# EAGLE design circuit1 (EAGLE 9.2.2)
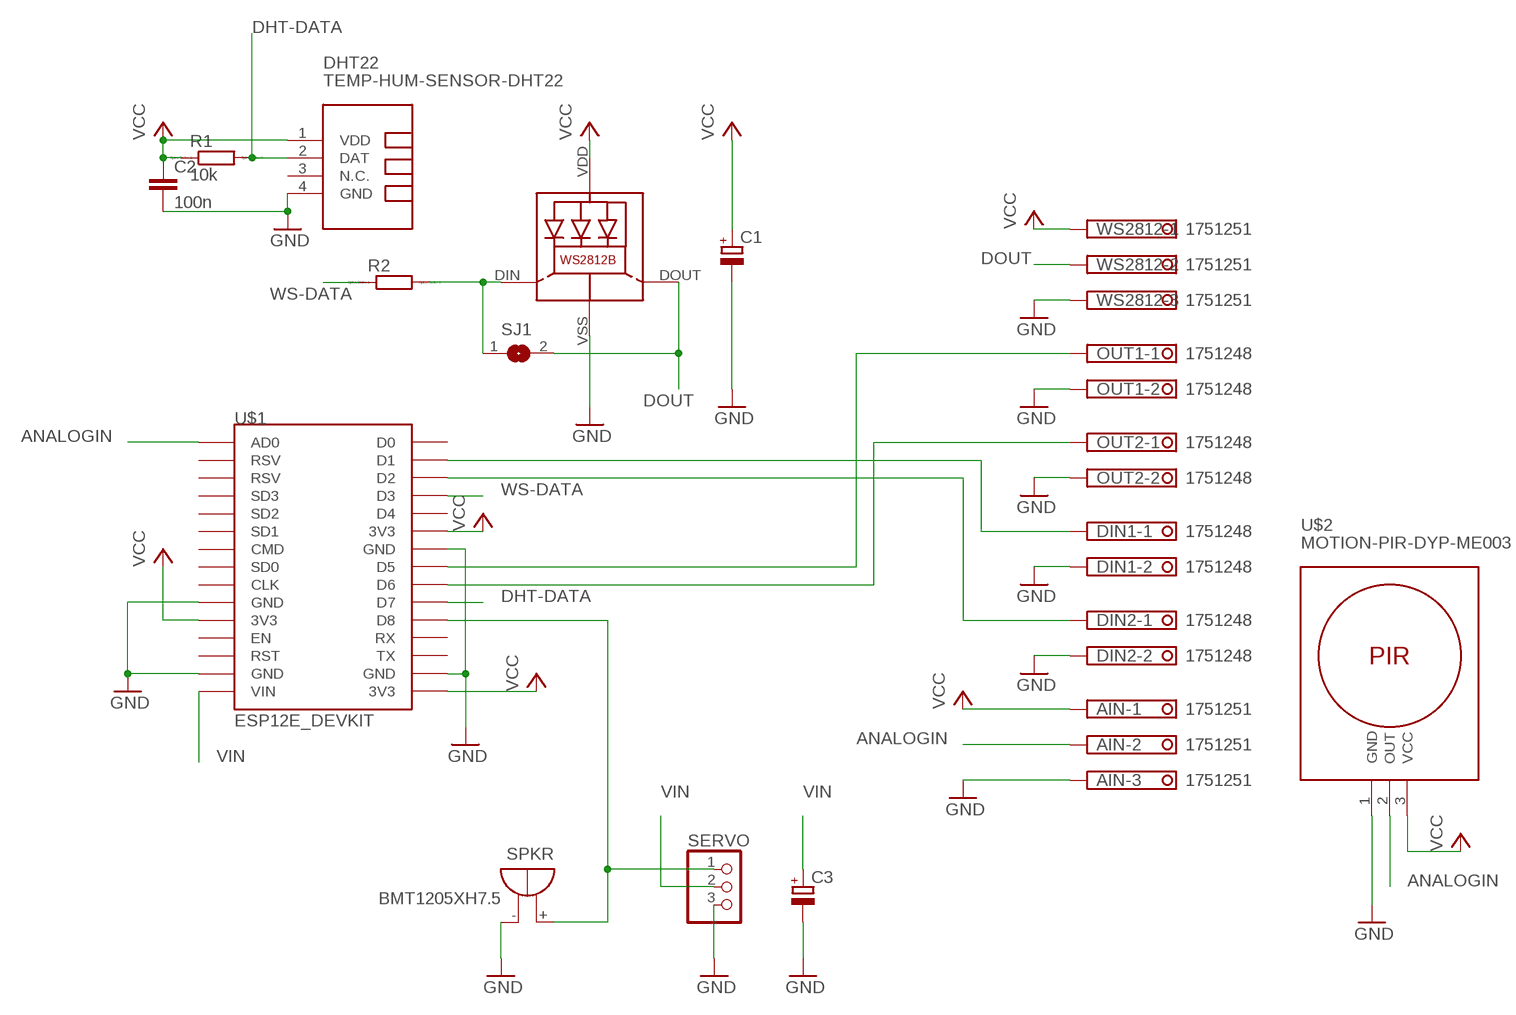
[diagram p0: schematic, sheet 1]

## Parts
AIN  1751251  [1751251]
C1  CPOL-EUE2.5-7  [E2,5-7]
C2  100n  C-EUC0805  [C0805]
C3  CPOL-EUE2.5-7  [E2,5-7]
DHT22  TEMP-HUM-SENSOR-DHT22  [TEMP-HUM-SENSOR-DHT22]
DIN1  1751248  [1751248]
DIN2  1751248  [1751248]
LED1  WS2812B  [WS2812B]
OUT1  1751248  [1751248]
OUT2  1751248  [1751248]
R1  10k  R0207/10  [0207/10]
R2  R0207/10  [0207/10]
SERVO  PINHD-1X3  [1X03]
SJ1  SJ  [SJ]
SPKR  BMT1205XH7.5  [BMT1205XH7.5]
U$1  ESP12E_DEVKIT  [ESP12E_DEVKIT]
U$2  MOTION-PIR-DYP-ME003  [MOTION-PIR-DYP-ME003]
WS2812  1751251  [1751251]

## Nets
ANALOGIN: AIN.2 U$1.AD0 U$2.2(OUT)
DHT-DATA: DHT22.2(DAT) R1.2 U$1.D7
DOUT: LED1.DOUT(DO) SJ1.2 WS2812.2
GND: AIN.3 C1.- C2.2 C3.- DHT22.4(GND) DIN1.2 DIN2.2 LED1.VSS(GND) OUT1.2 OUT2.2 SERVO.3 SPKR.- U$1.GND@0(GND) U$1.GND@1(GND) U$1.GND@2(GND) U$1.GND@3(GND) U$2.1(GND) WS2812.3
N$1: SERVO.1 SPKR.+ U$1.D8
N$5: OUT1.1 U$1.D5
N$7: OUT2.1 U$1.D6
N$9: DIN1.1 U$1.D1
N$11: DIN2.1 U$1.D2
VCC: AIN.1 C1.+ C2.1 DHT22.1(VDD) LED1.VDD R1.1 U$1.3V3@0(3V3) U$1.3V3@1(3V3) U$1.3V3@2(3V3) U$2.3(VCC) WS2812.1
VIN: C3.+ SERVO.2 U$1.VIN
WS: LED1.DIN(DI) R2.2 SJ1.1
WS-DATA: R2.1 U$1.D3
Unconnected: DHT22.3(N.C.) U$1.CLK U$1.CMD U$1.D0 U$1.D4 U$1.EN U$1.RST U$1.RSV@0(RSV) U$1.RSV@1(RSV) U$1.RX U$1.SD0 U$1.SD1 U$1.SD2 U$1.SD3 U$1.TX

## Library data of the parts
AIN WS2812 = con-phoenix-350:1751251: MKDS 1/ 3-3,5 Printklemme Nennstrom: 10 A Bemessungsspannung: 160 V Raster: 3,5 mm Polzahl: 3 Montageart: Löten Anschlussart: Schraubanschluss Anschlussrichtung vom Leiter zur Platine: 0° Source: http://eshop.phoenixcontact.com .. 1751251.pdf; OC_FARNELL: unknown; OC_NEWARK: unknown
C1 C3 = rcl:CPOL-EU: POLARIZED CAPACITOR, European symbol; SPICEPREFIX: C
C2 = rcl:C-EU: CAPACITOR, European symbol; SPICEPREFIX: C
DHT22 = diy-modules:TEMP-HUM-SENSOR-DHT22: DHT22 - digital humidity & temperature sensor Also known as: AM2302 AM2302 datasheet available here: http://akizukidenshi.com/download/ds/aosong/AM2302.pdf Click here to find device on ebay.com <http://www.ebay.com/sch/dht22+digital+sensor>
DIN1 DIN2 OUT1 OUT2 = con-phoenix-350:1751248: MKDS 1/ 2-3,5 Printklemme Nennstrom: 10 A Bemessungsspannung: 160 V Raster: 3,5 mm Polzahl: 2 Montageart: Löten Anschlussart: Schraubanschluss Anschlussrichtung vom Leiter zur Platine: 0° Source: http://eshop.phoenixcontact.com .. 1751248.pdf; OC_FARNELL: unknown; OC_NEWARK: unknown
LED1 = WS2812B:WS2812B: Features and Benefits  * Intelligent reverse connect protection, the power supply reverse connection does not damage the IC. * The control circuit and the LED share the only power source. Control circuit and RGB chip are integrated in a package of 5050 components, form a complete control of pixel point.  * Built-in signal reshaping circuit, after wave reshaping to the next driver, ensure wave-form distortion not accumulate.  * Built-in electric reset circuit and power lost reset circuit.  * Each pixel of the three primary color can achieve 256 brightness display, completed 16777216 color full color display, and scan frequency not less than 400Hz/s.  * Cascading port transmission signal by single line.  * Any two point the distance more than 5m transmission signal without any increase circuit.  * When the refresh rate is 30fps, cascade number are not less than1024 points.  * Send data at speeds of 800Kbps.  *The color of the light were highly consistent, cost-effective. Applications  Full-color module, Full color soft lights a lamp strip. LED decorative lighting, Indoor/outdoor LED video irregular screen. General description WS2812B is a intelligent control LED light source that the control circuit and RGB chip are integrated in a package of 5050 components. It internal include intelligent digital port data latch and signal reshaping amplification drive circuit. Also include a precision internal oscillator and a 12V voltage programmable constant curre-nt control part, effectively ensuring the pixel point light color height consistent. The data transfer protocol use single NZR communication mode. After the pixel power-on reset, the DIN port receive data from controller, the first pixel collect initial 24bit data then sent to the internal data latch, the other data which reshaping by the internal signal reshaping amplification circuit sent to the next cascade pixel through the DO port. After transmission for each pixel,the signal to reduce 24bit. pixel adopt auto reshaping transmit technology, making the pixel cascade number is not limited the signal transmission, only depend on the speed of signal transmission. LED with low driving voltage, environmental protection and energy saving, high brightness, scattering angle is large, good consistency, low power, long life and other advantages. The control chip integrated in LED above becoming more simple circuit, small volume, convenient installation. Absolute Maximum Ratings Power supply voltage: VDD +3.5V..+5.3V Input voltage: VI -0.5V..VDD+0.5V based on WS2812 from https://github.com/adafruit/Adafruit-Eagle-Library
R1 R2 = eagle-ltspice:R: RESISTOR, European symbol; SPICEMODEL: NONE; SPICEPREFIX: R
SERVO = pinhead:PINHD-1X3: PIN HEADER
SJ1 = jumper:SJ: SMD solder JUMPER
SPKR = buzzer:BMT1205XH7.5: MAGNETIC TRANSDUCER Source: Http:www.be-star.com; OC_FARNELL: unknown; OC_NEWARK: unknown
U$1 = ESP12E_DEVKIT:ESP12E_DEVKIT: ESP12E DEVKIT BOARD
U$2 = diy-modules:MOTION-PIR-DYP-ME003: PIR Motion Sensor Module DYP-ME003 based on BISS0001 pyroelectic detector Click here to find device on ebay.com <http://www.ebay.com/sch/dyp+me003>

## Board
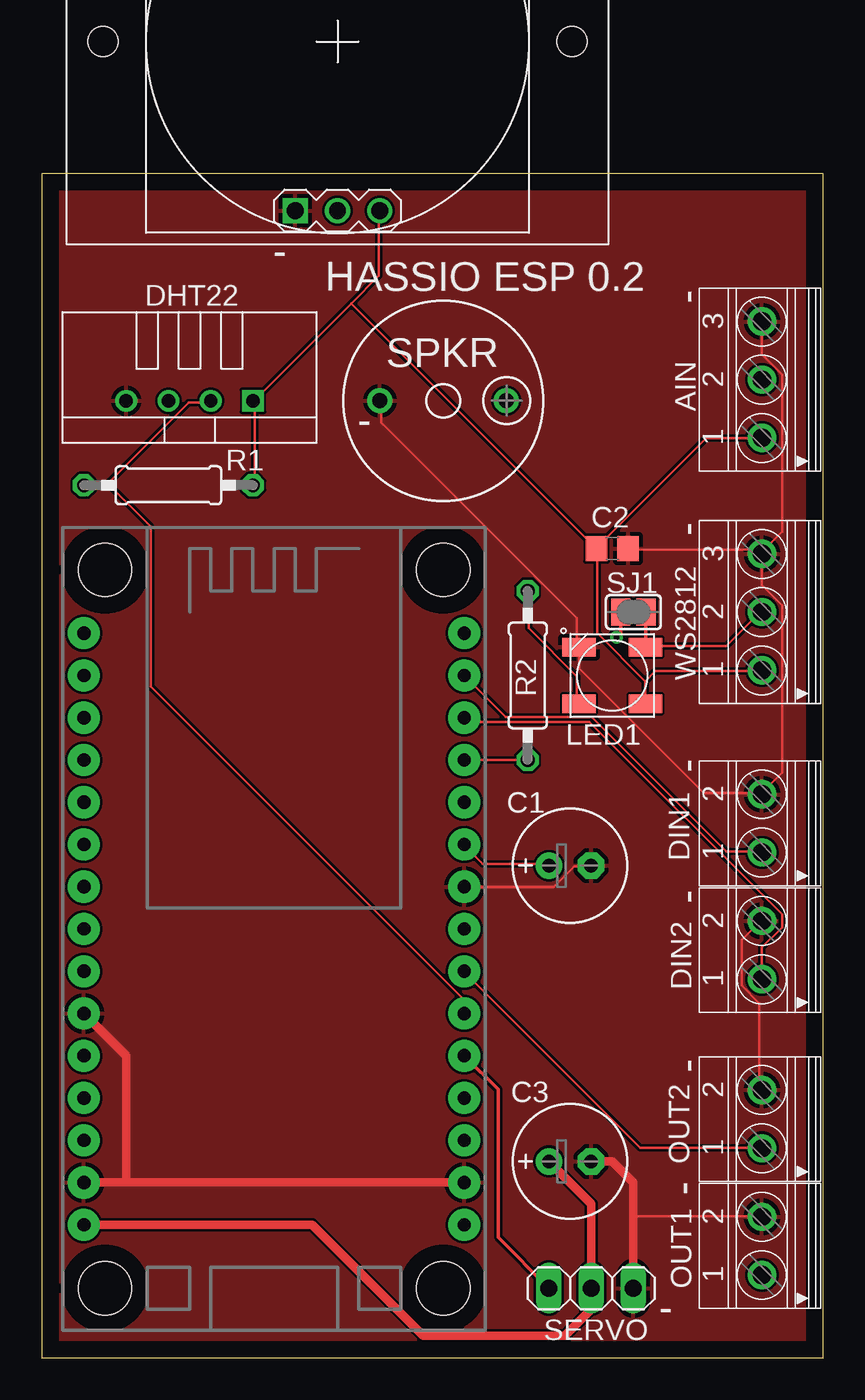
[diagram p1: board, top side]
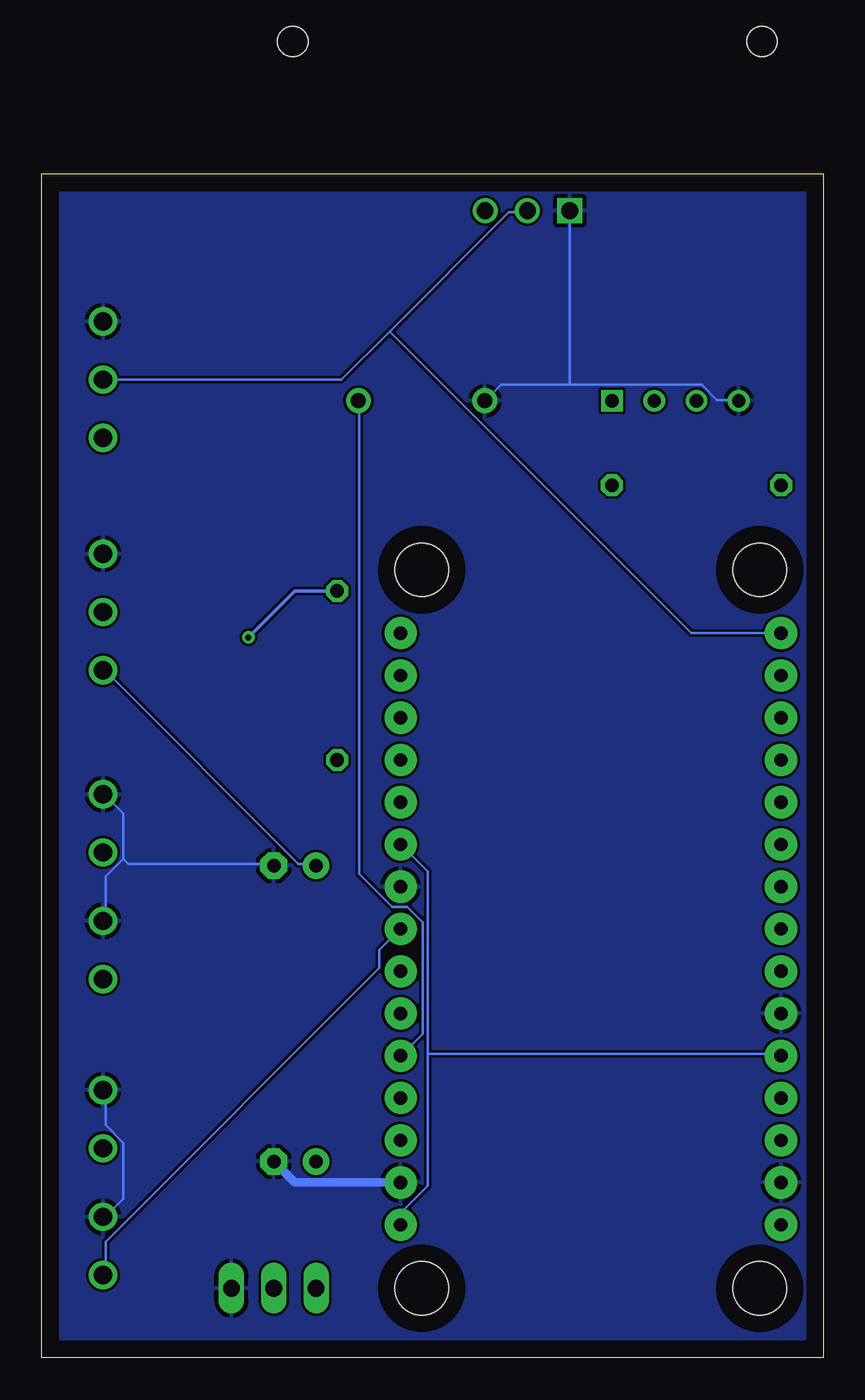
[diagram p2: board, bottom side, seen from below]

Size 46.97 x 71.17 mm. Coordinates in mm from the lower left corner, seen from the top.
Outline: 0,0 46.97,0 46.97,71.17 0,71.17 0,0
Copper layers (1*16): Top 0.035mm / dielectric 1.5mm / Bottom 0.035mm
Design rules "default": minimum track width 6mil, minimum drill 0.35mm, track to track 6mil, track to pad 6mil, pad to pad 6mil, via to via 6mil, smd to smd 6mil, copper to edge 40mil, drill to drill 6mil, minimum pad ring 10mil, minimum via ring 8mil, stop-mask expansion 4mil, vias tented up to drill 0mil, thermal gap 10mil

### Footprints (pad centres in the part's own frame; a part is rotated, then mirrored left to right if it is on the bottom)
1751251 = drill 1.1 pad 1.7: 1 -3.5,-0.1; 2 0,-0.1; 3 3.5,-0.1
E2,5-7 = drill 0.813 pad 1.6: + -1.27,0 | drill 0.813 pad 1.6 octagon: - 1.27,0
C0805 = smd 1.3 x 1.5: 1 -0.95,0; 2 0.95,0
TEMP-HUM-SENSOR-DHT22 = drill 0.8 square: 1 -3.81,0 | drill 0.8: 2 -1.27,0; 3 1.27,0; 4 3.81,0
1751248 = drill 1.1 pad 1.7: 1 -1.75,-0.1; 2 1.75,-0.1
WS2812B = smd 2 x 1.1: DIN 2,1.7; DOUT -2,-1.7; VDD -2,1.7; VSS 2,-1.7
0207/10 = drill 0.813 octagon: 1 -5.08,0; 2 5.08,0
1X03 = drill 1.016 long: 1 -2.54,0; 2 0,0; 3 2.54,0
SJ = smd 1.168 x 1.6: 1 -0.762,0; 2 0.762,0
BMT1205XH7.5 = drill 0.9 pad 1.5: + 3.8,0; - -3.8,0
ESP12E_DEVKIT = drill 0.8 pad 1.93: 3V3@0 -11.43,-7.62; 3V3@1 11.43,5.08; 3V3@2 11.43,-17.78; AD0 -11.43,17.78; CLK -11.43,-2.54; CMD -11.43,2.54; D0 11.43,17.78; D1 11.43,15.24; D2 11.43,12.7; D3 11.43,10.16; D4 11.43,7.62; D5 11.43,0; D6 11.43,-2.54; D7 11.43,-5.08; D8 11.43,-7.62; EN -11.43,-10.16; GND@0 -11.43,-5.08; GND@1 -11.43,-15.24; GND@2 11.43,2.54; GND@3 11.43,-15.24; RST -11.43,-12.7; RSV@0 -11.43,15.24; RSV@1 -11.43,12.7; RX 11.43,-10.16; SD0 -11.43,0; SD1 -11.43,5.08; SD2 -11.43,7.62; SD3 -11.43,10.16; TX 11.43,-12.7; VIN -11.43,-17.78 | hole 3.2: -10.16,21.59; 10.16,21.59; 10.16,-21.59; -10.16,-21.59
MOTION-PIR-DYP-ME003 = drill 1 square: 1 -2.54,-10.16 | drill 1: 2 0,-10.16; 3 2.54,-10.16 | hole 1.8: -14.1,0; 14.1,0

### Placement (x,y rotation side)
AIN  43.18,58.8 90 top
C1  31.75,29.59 0 top
C2  34.29,48.64 0 top
C3  31.75,11.81 0 top
DHT22  8.89,57.53 180 top
DIN1  43.18,32.13 90 top
DIN2  43.18,24.51 90 top
LED1  34.29,41.02 180 top
OUT1  43.18,6.73 90 top
OUT2  43.18,14.35 90 top
R1  7.62,52.45 180 top
R2  29.21,41.02 90 top
SERVO  33.02,4.19 0 top
SJ1  35.56,44.83 0 top
SPKR  24.13,57.53 0 top
U$1  13.97,25.78 0 top
U$2  17.78,79.12 0 top
WS2812  43.18,44.83 90 top

### Tracks (layer width: path | path; a pad name or v marks a point on that pad's centre or on a via)
ANALOGIN
  Bottom 0.152: 26.06,61.7 28.96,58.8 AIN.2 | 26.06,61.7 18.9,68.86 17.83,68.86 U$2.2 | U$1.AD0 7.92,43.56 26.06,61.7
DHT-DATA
  Top 0.152: 3.96,52.55 8.84,57.43 10.06,57.43 DHT22.2 | 3.96,52.55 2.59,52.55 R1.2 | 3.96,52.55 6.55,49.96 6.55,40.36 25.3,21.61 25.3,20.7 U$1.D7
DOUT
  Top 0.152: LED1.DOUT 36.42,42.8 41.15,42.8 43.13,44.78 WS2812.2
  Top 0.2: LED1.DOUT 36.29,44.8 SJ1.2
GND
  Top 0.152: 35.51,8.51 35.56,8.51 43.13,8.51 OUT1.2 | C2.2 35.36,48.59 42.98,48.59 43.13,48.44 WS2812.3 | AIN.3 43.28,62.15 43.28,60.33 44.5,59.11 44.5,49.66 43.28,48.44 WS2812.3 | U$1.GND@2 30.79,28.32 32,29.54 32.92,29.54 C1.- | WS2812.3 43.28,48.29 43.28,46.46 44.5,45.24 44.5,35.18 43.28,33.96 DIN1.2 43.13,33.96 39.78,33.96 32.31,41.43 32.31,42.65 LED1.VSS 32.16,42.8 32.16,44.48 20.42,56.21 20.42,57.43 SPKR.- | OUT2.2 43.13,16.13 43.13,21.31 42.06,22.38 42.06,25.12 43.13,26.19 DIN2.2
  Top 0.508: SERVO.3 35.56,8.51 35.56,10.54 34.29,11.81 C3.- | U$1.GND@1 5.08,10.54 | 5.08,10.54 U$1.GND@3 | U$1.GND@0 5.08,18.16 5.08,10.54
  Bottom 0.152: OUT2.2 43.13,15.98 43.13,13.99 42.06,12.93 42.06,9.58 43.13,8.51 OUT1.2 | 15.24,58.5 19.36,58.5 20.27,57.58 SPKR.- | 15.24,58.5 7.32,58.5 6.4,57.58 5.18,57.58 DHT22.4 | 15.24,58.5 U$2.1 | 42.06,30 43.13,28.93 43.13,26.34 DIN2.2 | 42.06,30 42.06,32.74 43.13,33.81 DIN1.2 | 42.06,30 41.76,29.69 33.07,29.69 C1.-
  Bottom 0.508: C3.- 31.75,10.54 U$1.GND@3
  pour Top: 0.51,70.74 46.48,70.74 46.48,0.38 0.51,0.38 0.51,70.48
  pour Bottom: 0.51,70.48 46.23,70.48 46.23,0.64 0.51,0.64 0.51,70.23
N$1
  Top 0.2: U$1.D8 27.43,16.13 27.43,7.24 SERVO.1
  Bottom 0.152: U$1.D8 24.08,19.48 24.08,26.19 24.99,27.1 25.91,27.1 27.89,29.08 27.89,57.43 SPKR.+
N$5
  Bottom 0.152: U$1.D5 26.67,24.51 26.67,23.44 43.13,6.98 43.13,5 OUT1.1
N$7
  Top 0.152: OUT2.1 43.13,12.62 35.97,12.62 25.45,23.14 U$1.D6
N$9
  Top 0.152: U$1.D1 27.89,38.53 33.07,38.53 41.15,30.45 43.13,30.45 DIN1.1
N$11
  Top 0.152: DIN2.1 43.28,22.84 43.28,24.66 44.5,25.88 44.5,26.64 32.92,38.23 25.6,38.23 25.45,38.38 U$1.D2
VCC
  Top 0.152: C1.+ 30.48,29.69 26.52,29.69 25.45,30.76 U$1.3V3@1 | R1.1 12.8,52.55 12.8,57.43 DHT22.1 12.8,57.58 18.59,63.37 | 18.59,63.37 20.27,65.05 20.27,68.86 U$2.3 | 36.27,40.67 33.38,43.56 33.38,48.59 C2.1 | 36.27,40.67 36.27,39.45 LED1.VDD | 36.27,40.67 36.88,41.28 43.13,41.28 WS2812.1 | AIN.1 43.13,55.3 39.93,55.3 33.38,48.74 C2.1 | 18.59,63.37 33.22,48.74 C2.1
  Bottom 0.152: 23.77,18.26 23.77,29.23 U$1.3V3@1 | 23.77,18.26 23.77,10.34 25.3,8.81 25.3,8.05 U$1.3V3@2 | 23.77,18.26 2.59,18.26 U$1.3V3@0 | C1.+ 30.48,29.69 31.55,29.69 43.13,41.28 WS2812.1
VIN
  Top 0.508: U$1.VIN 16.26,8 22.94,1.32 31.42,1.32 33.02,2.92 SERVO.2 33.02,9.27 C3.+
WS  (via drill 0.35)
  Top 0.152: LED1.DIN 32.16,39.45 32.16,40.97 29.26,43.87 29.26,46 R2.2
  Top 0.2: SJ1.1 34.8,43.56 v34.54,43.31
  Bottom 0.2: v34.54,43.31 31.75,46.1 R2.2
WS-DATA
  Top 0.152: U$1.D3 R2.1

### Text on the board
tNames: - | HASSIO ESP 0.2 | - | - | - | - | - | - | - | -